# EAGLE design AFM_QFM_input (EAGLE 9.6.2)
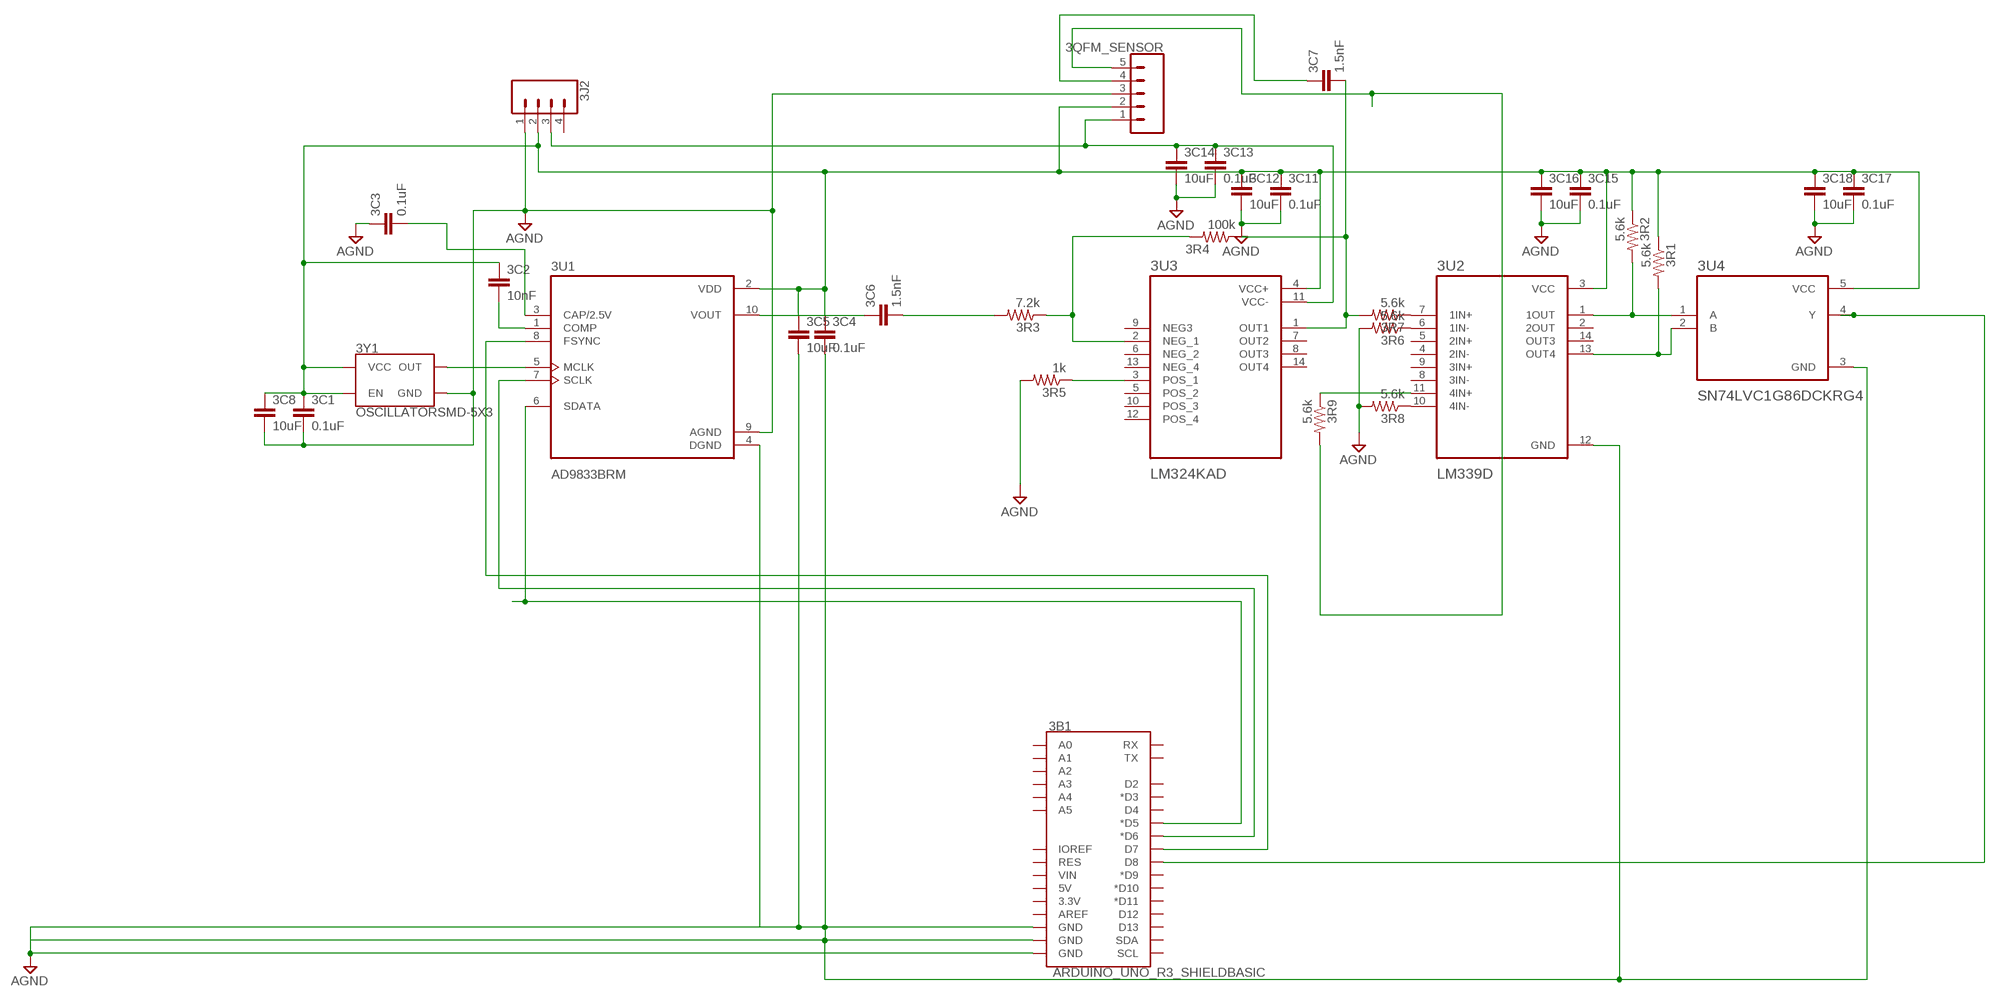
[diagram p0: schematic, sheet 1]

## Parts
3B1  ARDUINO_UNO_R3_SHIELDBASIC  [UNO_R3_SHIELD]
3C1  0.1uF  0.1UF-0603-100V-10%  [0603]
3C2  10nF  10NF-0603-50V-10%  [0603]
3C3  0.1uF  0.1UF-0603-100V-10%  [0603]
3C4  0.1uF  0.1UF-0603-100V-10%  [0603]
3C5  10uF  10UF-0805-10V-10%  [0805]
3C6  1.5nF  C-EUC0603  [C0603]
3C7  1.5nF  C-EUC0603  [C0603]
3C8  10uF  10UF-0805-10V-10%  [0805]
3C11  0.1uF  0.1UF-0603-100V-10%  [0603]
3C12  10uF  10UF-0805-10V-10%  [0805]
3C13  0.1uF  0.1UF-0603-100V-10%  [0603]
3C14  10uF  10UF-0805-10V-10%  [0805]
3C15  0.1uF  0.1UF-0603-100V-10%  [0603]
3C16  10uF  10UF-0805-10V-10%  [0805]
3C17  0.1uF  0.1UF-0603-100V-10%  [0603]
3C18  10uF  10UF-0805-10V-10%  [0805]
3J2  CONN_04LONGPADS  [1X04_LONGPADS]
3QFM_SENSOR  CONN_05PTH_LONGPADS  [1X05_LONGPADS]
3R1  5.6k  R-US_R0603  [R0603]
3R2  5.6k  R-US_R0603  [R0603]
3R3  7.2k  R-US_R0603  [R0603]
3R4  100k  R-US_R0603  [R0603]
3R5  1k  R-US_R0603  [R0603]
3R6  5.6k  R-US_R0603  [R0603]
3R7  5.6k  R-US_R0603  [R0603]
3R8  5.6k  R-US_R0603  [R0603]
3R9  5.6k  R-US_R0603  [R0603]
3U1  AD9833BRM  [SOP50P490X110-10N]
3U2  LM339D  [SOIC127P600X175-14N]
3U3  LM324KAD  [SOIC127P600X175-14N]
3U4  SN74LVC1G86DCKRG4  [SOT65P210X110-5N]
3Y1  OSCILLATORSMD-5X3  [OSCILLATOR-SMD-5X3.2]

## Nets
AGND: 3B1.GND@0(GND) 3B1.GND@1(GND) 3B1.GND@2(GND) 3C1.2 3C3.1 3C4.2 3C5.2 3C8.2 3C11.2 3C12.2 3C13.2 3C14.2 3C15.2 3C16.2 3C17.2 3C18.2 3J2.1 3QFM_SENSOR.3 3R5.2 3R6.2 3R8.2 3U1.4(DGND) 3U1.9(AGND) 3U2.12(GND) 3U4.3(GND) 3Y1.2(GND)
N$1: 3B1.D7 3U1.8(FSYNC)
N$2: 3U1.5(MCLK) 3Y1.3(OUT)
N$3: 3B1.D6(*D6) 3U1.7(SCLK)
N$4: 3B1.D5(*D5) 3U1.6(SDATA)
N$5: 3C2.2 3U1.1(COMP)
N$6: 3C6.1 3U1.10(VOUT)
N$7: 3C3.2 3U1.3(CAP/2.5V)
N$8: 3C6.2 3R3.2
N$10: 3R3.1 3R4.2 3U3.2(NEG_1)
N$11: 3C7.1 3QFM_SENSOR.4
N$12: 3C7.2 3R4.1 3R7.2 3U3.1(OUT1)
N$13: 3R5.1 3U3.3(POS_1)
N$14: 3R6.1 3U2.6(1IN-)
N$15: 3R7.1 3U2.7(1IN+)
N$16: 3R2.2 3U2.1(1OUT) 3U4.1(A)
N$17: 3R8.1 3U2.10(4IN-)
N$18: 3R9.1 3U2.11(4IN+)
N$19: 3QFM_SENSOR.5 3R9.2
N$21: 3R1.2 3U2.13(OUT4) 3U4.2(B)
N$22: 3B1.D8 3U4.4(Y)
VCC: 3C13.1 3C14.1 3J2.3 3QFM_SENSOR.1 3U3.11(VCC-)
VDD3: 3C1.1 3C2.1 3C4.1 3C5.1 3C8.1 3C11.1 3C12.1 3C15.1 3C16.1 3C17.1 3C18.1 3J2.2 3QFM_SENSOR.2 3R1.1 3R2.1 3U1.2(VDD) 3U2.3(VCC) 3U3.4(VCC+) 3U4.5(VCC) 3Y1.1(EN) 3Y1.4(VCC)
Unconnected: 3B1.3.3V 3B1.5V 3B1.A0 3B1.A1 3B1.A2 3B1.A3 3B1.A4 3B1.A5 3B1.AREF 3B1.D2 3B1.D3(*D3) 3B1.D4 3B1.D9(*D9) 3B1.D10(*D10) 3B1.D11(*D11) 3B1.D12 3B1.D13 3B1.IOREF 3B1.RES 3B1.RX 3B1.SCL 3B1.SDA 3B1.TX 3B1.VIN 3J2.4 3U2.2(2OUT) 3U2.4(2IN-) 3U2.5(2IN+) 3U2.8(3IN-) 3U2.9(3IN+) 3U2.14(OUT3) 3U3.5(POS_2) 3U3.6(NEG_2) 3U3.7(OUT2) 3U3.8(OUT3) 3U3.9(NEG3) 3U3.10(POS_3) 3U3.12(POS_4) 3U3.13(NEG_4) 3U3.14(OUT4)

## Library data of the parts
3B1 = SparkFun-Boards:ARDUINO_UNO_R3_SHIELD: Arduino R3 Shield Footprint Shield form compatible with the Arduino Uno R3. SparkFun Products: MG2639 Cellular Shield <https://www.sparkfun.com/products/13120> MIDI Shield <https://www.sparkfun.com/products/12898> R3 Stackable Headers Kit <https://www.sparkfun.com/products/11417>
3C1 3C3 3C4 3C11 3C13 3C15 3C17 = SparkFun-Capacitors:0.1UF: 0.1µF ceramic capacitors A capacitor is a passive two-terminal electrical component used to store electrical energy temporarily in an electric field.; PROD_ID: CAP-08390
3C2 = SparkFun-Capacitors:10NF: 0.01uF/10nF/10,000pF ceramic capacitors A capacitor is a passive two-terminal electrical component used to store electrical energy temporarily in an electric field. CAP-09321; PROD_ID: CAP-00867
3C5 3C8 3C12 3C14 3C16 3C18 = SparkFun-Capacitors:10UF: 10.0µF ceramic capacitors A capacitor is a passive two-terminal electrical component used to store electrical energy temporarily in an electric field.; PROD_ID: CAP-11330
3C6 3C7 = resistor:C-EU: CAPACITOR, European symbol
3J2 = SparkFun-Connectors:CONN_04: Multi connection point. Often used as Generic Header-pin footprint for 0.1 inch spaced/style header connections On any of the 0.1 inch spaced packages, you can populate with these: Break Away Headers - Straight <https://www.sparkfun.com/products/116> (PRT-00116) Break Away Male Headers - Right Angle <https://www.sparkfun.com/products/553> (PRT-00553) Female Headers <https://www.sparkfun.com/products/115> (PRT-00115) Break Away Headers - Machine Pin <https://www.sparkfun.com/products/117> (PRT-00117) Break Away Female Headers - Swiss Machine Pin <https://www.sparkfun.com/products/743> (PRT-00743) For SCREWTERMINALS and SPRING TERMINALS visit here: Screw Terimnals on SparkFun.com <https://www.sparkfun.com/search/results?term=Screw+Terminals> (5mm/3.5mm/2.54mm spacing) This device is also useful as a general connection point to wire up your design to another part of your project. Our various solder wires solder well into these plated through hole pads. Hook-Up Wire - Assortment (Stranded, 22 AWG) <https://www.sparkfun.com/products/11375> (PRT-11375) Hook-Up Wire - Assortment (Solid Core, 22 AWG) <https://www.sparkfun.com/products/11367> (PRT-11367) View the entire wire category on our website here <https://www.sparkfun.com/categories/141> Special notes: Molex polarized connector foot print use with SKU : PRT-08231 with associated crimp pins and housings. 1MM SMD Version SKU: PRT-10208; PROD_ID: CONN-09696
3QFM_SENSOR = SparkFun-Connectors:CONN_05: Multi connection point. Often used as Generic Header-pin footprint for 0.1 inch spaced/style header connections On any of the 0.1 inch spaced packages, you can populate with these: Break Away Headers - Straight <https://www.sparkfun.com/products/116> (PRT-00116) Break Away Male Headers - Right Angle <https://www.sparkfun.com/products/553> (PRT-00553) Female Headers <https://www.sparkfun.com/products/115> (PRT-00115) Break Away Headers - Machine Pin <https://www.sparkfun.com/products/117> (PRT-00117) Break Away Female Headers - Swiss Machine Pin <https://www.sparkfun.com/products/743> (PRT-00743) For SCREWTERMINALS and SPRING TERMINALS visit here: Screw Terimnals on SparkFun.com <https://www.sparkfun.com/search/results?term=Screw+Terminals> (5mm/3.5mm/2.54mm spacing) This device is also useful as a general connection point to wire up your design to another part of your project. Our various solder wires solder well into these plated through hole pads. Hook-Up Wire - Assortment (Stranded, 22 AWG) <https://www.sparkfun.com/products/11375> (PRT-11375) Hook-Up Wire - Assortment (Solid Core, 22 AWG) <https://www.sparkfun.com/products/11367> (PRT-11367) View the entire wire category on our website here <https://www.sparkfun.com/categories/141> Special notes: Molex polarized connector foot print use with SKU : PRT-08231 with associated crimp pins and housings. 1MM SMD Version SKU: PRT-10208
3R1-3R9 = rcl:R-US_: RESISTOR, American symbol; SPICEPREFIX: R
3U1 = AD9833BRM:AD9833BRM: Direct Digital Synthesizer 25MHz 1-DAC 10-Bit Serial 10-Pin MSOP Tube Check availability <https://pricing.snapeda.com/parts/AD9833BRM/Analog%20Devices/view-part?ref=eda>; AVAILABILITY: In Stock; CHECK_PRICES: https://www.snapeda.com/parts/AD9833BRM/Analog+Devices/view-part/?ref=eda; DESCRIPTION: Direct Digital Synthesis IC 10 b 25 MHz 28 b Tuning 10-MSOP; MF: Analog Devices; MP: AD9833BRM; PACKAGE: MSOP-10 Analog Devices; PRICE: None; PURCHASE-URL: https://www.snapeda.com/api/url_track_click_mouser/?unipart_id=107089&manufacturer=Analog Devices&part_name=AD9833BRM&search_term=ad9833; SNAPEDA_LINK: https://www.snapeda.com/parts/AD9833BRM/Analog+Devices/view-part/?ref=snap
3U2 = LM339D:LM339D: Check availability <https://pricing.snapeda.com/parts/LM339D/Texas%20Instruments/view-part?ref=eda>; AVAILABILITY: In Stock; CHECK_PRICES: https://www.snapeda.com/parts/LM339D/Texas+Instruments/view-part/?ref=eda; DESCRIPTION: Quad differential comparator; MF: Texas Instruments; MP: LM339D; PACKAGE: SOIC-14 Texas Instruments; PRICE: None; PURCHASE-URL: https://www.snapeda.com/api/url_track_click_mouser/?unipart_id=4792513&manufacturer=Texas Instruments&part_name=LM339D&search_term=lm339; SNAPEDA_LINK: https://www.snapeda.com/parts/LM339D/Texas+Instruments/view-part/?ref=snap
3U3 = LM324KAD:LM324KAD: Check availability <https://pricing.snapeda.com/parts/LM324KAD/Texas%20Instruments/view-part?ref=eda>; AVAILABILITY: In Stock; CHECK_PRICES: https://www.snapeda.com/parts/LM324KAD/Texas+Instruments/view-part/?ref=eda; DESCRIPTION: Quad, 30-V, 1.2-MHz, 3-mV offset voltage, improved ESD (2kV) operational amplifier; MF: Texas Instruments; MP: LM324KAD; PACKAGE: SOIC-14 Texas Instruments; PRICE: None; PURCHASE-URL: https://www.snapeda.com/api/url_track_click_mouser/?unipart_id=497506&manufacturer=Texas Instruments&part_name=LM324KAD&search_term=lm324; SNAPEDA_LINK: https://www.snapeda.com/parts/LM324KAD/Texas+Instruments/view-part/?ref=snap
3U4 = SN74LVC1G86DCKRG4:SN74LVC1G86DCKRG4: Check availability <https://pricing.snapeda.com/parts/SN74LVC1G86DCKRG4/Texas%20Instruments/view-part?ref=eda>; AVAILABILITY: In Stock; CHECK_PRICES: https://www.snapeda.com/parts/SN74LVC1G86DCKRG4/Texas+Instruments/view-part/?ref=eda; DESCRIPTION: Single 2-input, 1.65-V to 5.5-V XOR (exclusive OR) gate; MF: Texas Instruments; MP: SN74LVC1G86DCKRG4; PACKAGE: SC70-5 Texas Instruments; PRICE: None; SNAPEDA_LINK: https://www.snapeda.com/parts/SN74LVC1G86DCKRG4/Texas+Instruments/view-part/?ref=snap
3Y1 = SparkFun-Clocks:OSCILLATOR: Oscillators (Generic) These are active oscillators, which require a power source to generate their clock output. Most oscillators are configured to generate a set frequency (e.g. 16MHz). They have four pins: power, ground, output, and an enable input.

## Board
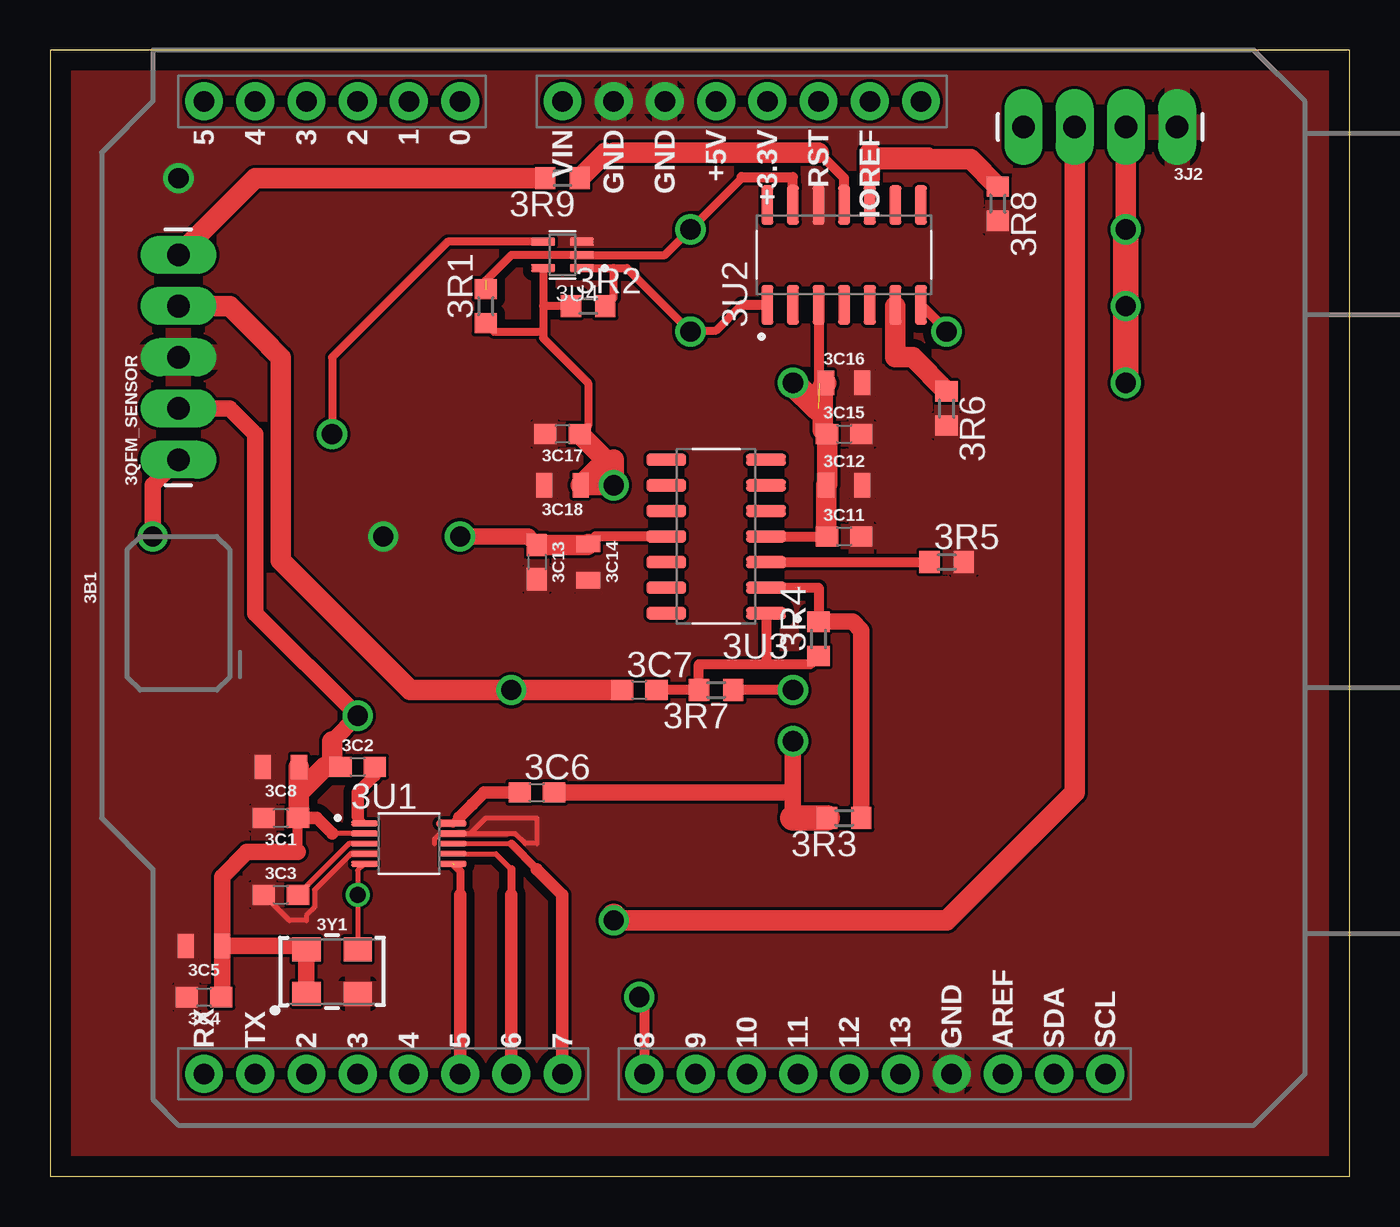
[diagram p1: board, top side]
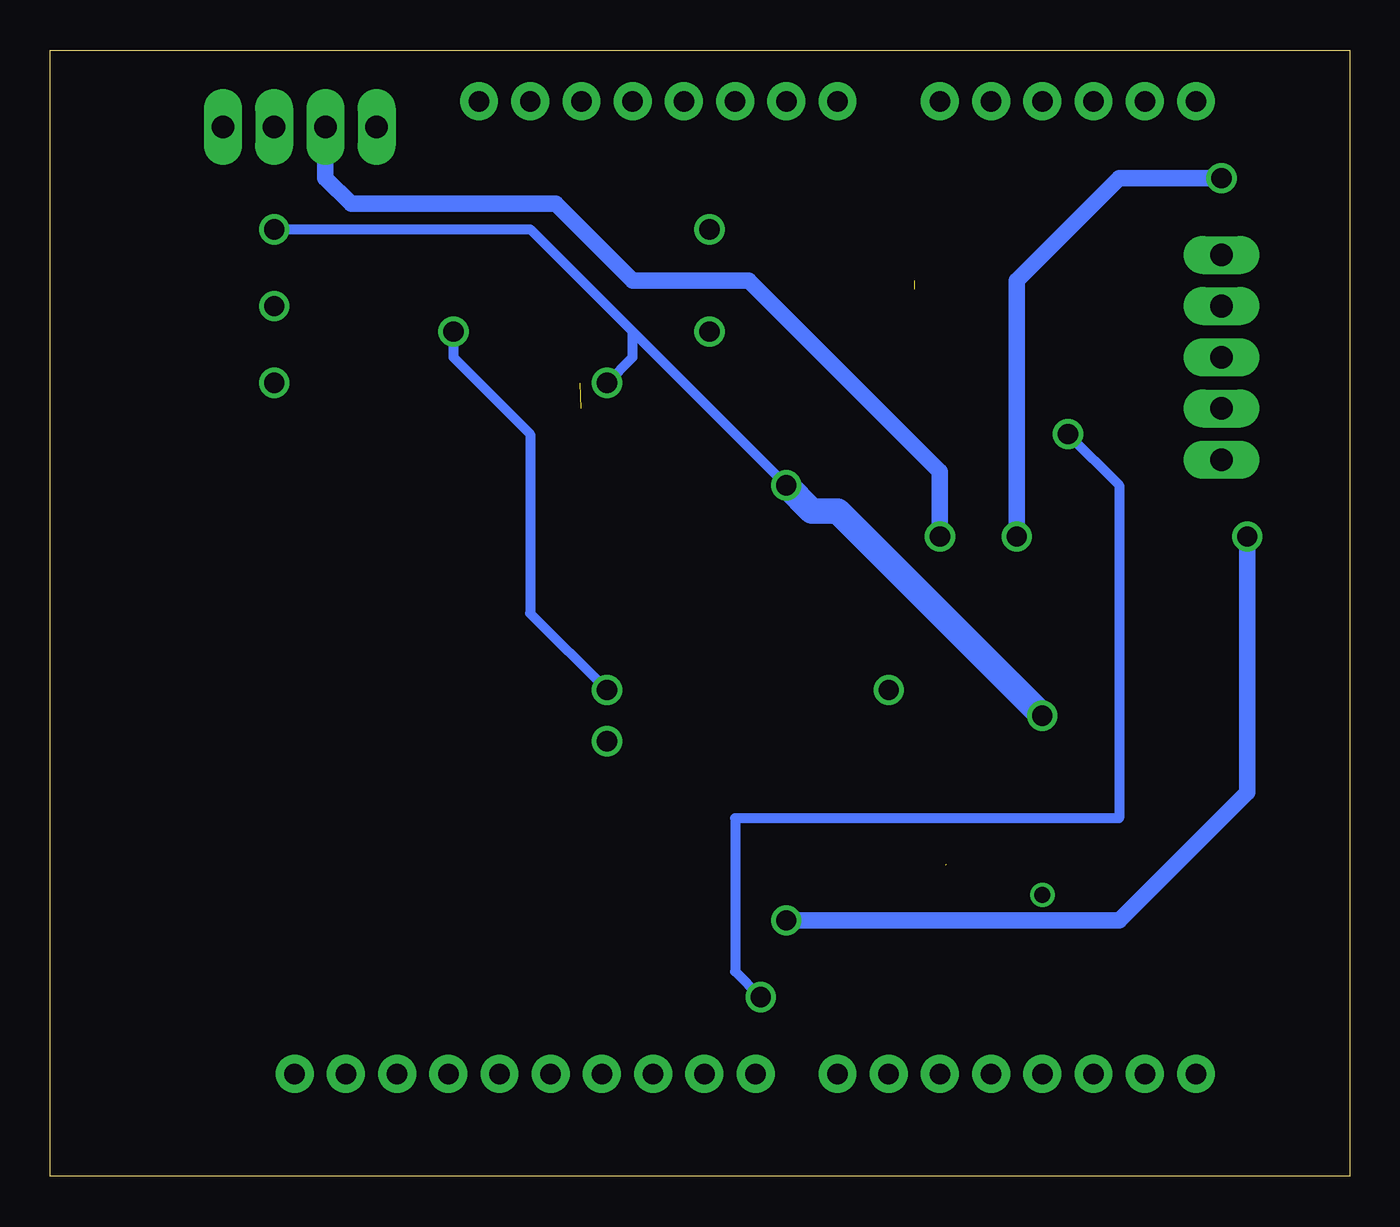
[diagram p2: board, bottom side, seen from below]

Size 64.44 x 55.87 mm. Coordinates in mm from the lower left corner, seen from the top.
Outline: 0,0 64.44,0 64.44,55.87 0,55.87 0,0
Copper layers (1*16): Top 0.035mm / dielectric 1.5mm / Bottom 0.035mm
Design rules "default": minimum track width 6mil, minimum drill 0.35mm, track to track 6mil, track to pad 6mil, pad to pad 6mil, via to via 6mil, smd to smd 6mil, copper to edge 40mil, drill to drill 6mil, minimum pad ring 10mil, minimum via ring 8mil, stop-mask expansion 4mil, vias tented up to drill 0mil, thermal gap 10mil

### Footprints (pad centres in the part's own frame; a part is rotated, then mirrored left to right if it is on the bottom)
UNO_R3_SHIELD = drill 1.016 pad 1.88: 3.3V 24.13,-2.54; 5V 24.13,0; A0 24.13,12.7; A1 24.13,15.24; A2 24.13,17.78; A3 24.13,20.32; A4 24.13,22.86; A5 24.13,25.4; AREF -24.13,-14.224; D2 -24.13,20.32; D3 -24.13,17.78; D4 -24.13,15.24; D5 -24.13,12.7; D6 -24.13,10.16; D7 -24.13,7.62; D8 -24.13,3.556; D9 -24.13,1.016; D10 -24.13,-1.524; D11 -24.13,-4.064; D12 -24.13,-6.604; D13 -24.13,-9.144; GND@0 24.13,2.54; GND@1 24.13,5.08; GND@2 -24.13,-11.684; IOREF 24.13,-7.62; NC 24.13,-10.16; RES 24.13,-5.08; RX -24.13,25.4; SCL -24.13,-19.304; SDA -24.13,-16.764; TX -24.13,22.86; VIN 24.13,7.62
0603 = smd 1.1 x 1: 1 -0.85,0; 2 0.85,0
0805 = smd 0.8 x 1.2: 1 -0.9,0; 2 0.9,0
C0603 = smd 1.1 x 1: 1 -0.85,0; 2 0.85,0
1X04_LONGPADS = drill 1.118 pad 1.88 long: 1 0,0; 2 2.54,0; 3 5.08,0; 4 7.62,0
1X05_LONGPADS = drill 1.118 pad 1.88 long: 1 0,0; 2 2.54,0; 3 5.08,0; 4 7.62,0; 5 10.16,0
R0603 = smd 1 x 1.1: 1 -0.85,0; 2 0.85,0
SOP50P490X110-10N = smd 1.32 x 0.28: 1 -2.2,1; 2 -2.2,0.5; 3 -2.2,0; 4 -2.2,-0.5; 5 -2.2,-1; 6 2.2,-1; 7 2.2,-0.5; 8 2.2,0; 9 2.2,0.5; 10 2.2,1
SOIC127P600X175-14N = smd 1.97 x 0.6: 1 -2.475,3.81; 2 -2.475,2.54; 3 -2.475,1.27; 4 -2.475,0; 5 -2.475,-1.27; 6 -2.475,-2.54; 7 -2.475,-3.81; 8 2.475,-3.81; 9 2.475,-2.54; 10 2.475,-1.27; 11 2.475,0; 12 2.475,1.27; 13 2.475,2.54; 14 2.475,3.81
SOT65P210X110-5N = smd 1.19 x 0.4: 1 -0.96,0.65; 2 -0.96,0; 3 -0.96,-0.65; 4 0.96,-0.65; 5 0.96,0.65
OSCILLATOR-SMD-5X3.2 = smd 1.397 x 1.194: 1 -1.27,-1.1; 2 1.27,-1.1; 3 1.27,1.1; 4 -1.27,1.1

### Placement (x,y rotation side)
3B1  33.02,29.21 90 top
3C1  11.43,17.78 180 top
3C2  15.24,20.32 0 top
3C3  11.43,13.97 0 top
3C4  7.62,8.89 180 top
3C5  7.62,11.43 180 top
3C6  24.13,19.05 0 top
3C7  29.21,24.13 0 top
3C8  11.43,20.32 180 top
3C11  39.37,31.75 0 top
3C12  39.37,34.29 0 top
3C13  24.13,30.48 270 top
3C14  26.67,30.48 270 top
3C15  39.37,36.83 0 top
3C16  39.37,39.37 0 top
3C17  25.4,36.83 180 top
3C18  25.4,34.29 180 top
3J2  55.88,52.07 180 top
3QFM_SENSOR  6.35,35.56 90 top
3R1  21.59,43.18 90 top
3R2  26.67,43.18 0 top
3R3  39.37,17.78 180 top
3R4  38.1,26.67 90 top
3R5  44.45,30.48 0 top
3R6  44.45,38.1 270 top
3R7  33.02,24.13 180 top
3R8  46.99,48.26 270 top
3R9  25.4,49.53 180 top
3U1  17.78,16.51 0 top
3U2  39.37,45.72 90 top
3U3  33.02,31.75 180 top
3U4  25.4,45.72 180 top
3Y1  13.97,10.16 0 top

### Tracks (layer width: path | path; a pad name or v marks a point on that pad's centre or on a via)
AGND  (via drill 1)
  Top 0.254: 3U1.4 14.89,16.01 13.11,14.22 13.11,13.35 12.7,12.95 12.7,12.7 11.85,12.7 3C3.1 | 3U1.9 20.82,17.01 21.59,17.78 24.13,17.78 24.13,16.51 23.54,16.51 23.06,16.99 19.31,16.99 19.04,16.73 19.04,16.51
  Bottom 0.813: v16.51,31.75 16.51,44.45 11.43,49.53 v6.35,49.53
  pour Top (isolate 0.406, rank 6): 0,55.88 64.77,55.88 64.77,0 0,0
  pour Top: 63.5,55.88 63.5,0 -1.27,0 -1.27,55.88
  pour Top: 64.77,55.88 64.77,0 -1.27,0 -1.27,55.88
  pour Top (isolate 0.254): 64.77,55.88 64.77,0 -1.27,0 -1.27,55.88
  pour Top (isolate 0.406): 64.77,55.88 64.77,0 -1.27,0 -1.27,55.88
N$1
  Top 0.254: 3U1.8 22.86,16.51
  Top 0.406: 22.86,16.51 24.13,15.24
  Top 0.61: 3B1.D7 25.4,13.97 24.13,15.24
N$2  (via drill 0.8)
  Top 0.254: 3U1.5 15.24,15.17 v15.24,13.97 15.24,11.43
  Top 0.305: 15.24,11.43 3Y1.3
N$3
  Top 0.254: 3U1.7 22.09,16.01 22.86,15.24
  Top 0.406: 22.86,15.24 22.86,13.97
  Top 0.61: 3B1.D6 22.86,13.97
N$4  (1 unrouted)
  Top 0.305: 20.29,15.21 20.32,15.17
  Top 0.406: 20.04,15.45 20.25,15.24 20.32,15.17 20.32,13.97
  Top 0.61: 3B1.D5 20.32,13.97
N$5
  Top 0.305: 15.24,17.85 3U1.1
  Top 0.61: 3C2.2 16.09,19.9 15.24,19.05 15.24,17.85
N$6
  Top 0.305: 20.29,17.82 3U1.10
  Top 0.406: 19.32,17.51 3U1.10 20.92,18.45
  Top 0.61: 3C6.1 21.52,19.05 20.92,18.45 20.29,17.82
N$7
  Top 0.254: 3U1.3 14.82,16.51 3C3.2
N$8  (via drill 1)
  Top 0.813: v36.83,21.59 36.83,19.05 | 36.83,19.05 36.83,17.78 | 3C6.2 36.83,19.05
  Top 1.27: 36.83,17.78 3R3.2
N$10
  Top 0.508: 3U3.2 38.1,29.21 3R4.2
  Top 0.813: 3R3.1 40.22,27.09 39.79,27.52 3R4.2
N$11  (via drill 1)
  Top 0.508: 11.43,30.55 11.43,40.64 8.89,43.18
  Top 1.016: 3QFM_SENSOR.4 8.89,43.18 10.89,41.18 10.89,41.16 11.43,40.62 11.43,30.55 17.84,24.13 v22.86,24.13 3C7.1
N$12
  Top 0.508: 3U3.1 35.5,25.4 | 3R4.1 37.68,25.4 35.5,25.4 | 35.5,25.4 32.17,25.4 3R7.2 3C7.2
N$13
  Top 0.508: 3U3.3 3R5.1
N$14
  Top 0.508: 41.91,43.18 3U2.6
  Top 1.016: 3R6.1 42.76,40.64 41.91,40.64 41.91,43.18
N$15  (via drill 1)
  Top 0.508: v36.83,24.13 3R7.1 | 3U2.7 44.45,41.98 v44.45,41.91
  Bottom 0.508: v36.83,24.13 40.64,27.94 40.64,36.83 44.45,40.64 v44.45,41.91
N$16  (via drill 1)
  Top 0.406: 3U4.1 27.94,45.07 | 27.94,45.07 28.59,45.07 31.68,41.98 31.75,41.98 | 31.75,41.98 33.02,41.98 34.29,43.24 | v31.75,41.91 31.75,41.98 | 3R2.2 27.94,43.6 27.94,45.07
  Top 0.508: 34.29,43.24 3U2.1
N$17
  Top 0.508: 3U2.10 40.64,49.53 40.64,50.8 43.6,50.8 44.28,50.46
  Top 1.016: 3R8.1 45.64,50.46 44.28,50.46 40.98,50.46 | 40.98,50.46 40.64,50.8 | 40.98,50.46 40.64,50.12 40.64,49.53
N$18
  Top 0.508: 3U2.11 39.37,49.53 38.1,50.8 | 27.52,50.8 27.94,50.8
  Top 1.016: 3R9.1 27.52,50.8 | 27.94,50.8 38.1,50.8
N$19
  Top 0.508: 24.13,49.53 3R9.2
  Top 1.016: 3QFM_SENSOR.5 10.16,49.53 24.13,49.53
N$21  (via drill 1)  (1 unrouted)
  Top 0.406: 34.29,49.59 34.29,49.53 v31.75,46.99 30.48,45.72 3U4.2 22.86,45.72 21.59,44.45
  Top 0.508: 3U2.13 36.83,49.59 34.29,49.59
N$22  (via drill 1)
  Top 0.406: 3U4.4 19.7,46.37 13.97,40.64 v13.97,36.83
  Top 0.508: v29.21,8.89 29.46,8.64 3B1.D8
  Bottom 0.508: v13.97,36.83 11.43,34.29 11.43,17.78 30.48,17.78 30.48,10.16 v29.21,8.89
VCC  (via drill 1)
  Top 0.508: 3U3.11 27.04,31.75 3C14.1
  Top 0.813: 3QFM_SENSOR.1 5.08,34.29 v5.08,31.75 | 3C13.1 23.71,31.75 v20.32,31.75
  Top 1.016: v27.94,12.7 44.45,12.7 50.8,19.05 3J2.3 | 3C14.1 26.62,31.33 3C13.1
  Top 1.27: v27.94,12.7 27.94,12.9
  Bottom 0.813: v27.94,12.7 11.43,12.7 5.08,19.05 v5.08,31.75 | v20.32,31.75 20.32,34.98 29.79,44.45 35.56,44.45 39.37,48.26 49.53,48.26 50.8,49.53 3J2.3
VDD3  (via drill 1)  (1 unrouted)
  Top 0.254: 3U1.2 13.97,17.01
  Top 0.305: 12.33,17.83 3C1.1 | 3C8.1 12.51,20.14 12.51,19.23 | 13.6,20.32 13.97,20.32 3C2.1 | 12.62,11.35 3Y1.4 8.59,11.26 8.47,11.38 | 3C4.1 8.47,11.38 | 8.47,11.38 3C5.1
  Top 0.406: 3U4.5 24.44,43.18 | 24.44,43.18 24.44,41.91 | 24.44,41.91 24.44,41.6 26.67,39.37 26.67,37.25 3C17.1 | 3R1.1 22.01,41.91 24.44,41.91 | 3R2.1 24.44,43.18
  Top 0.508: 12.28,16.09 3C1.1 | 3U3.4 3C11.1 38.47,31.8 | 3C16.1 38.17,39.37 | 3C15.1 38.31,37.04 38.1,37.25 3U2.3
  Top 0.61: 3C1.1 13.2,17.78 13.97,17.01
  Top 0.813: 3C5.1 12.53,11.43 12.62,11.35 | 3Y1.4 3Y1.1 | 3C5.1 8.52,8.94 3C4.1 | 13.97,21.59 v15.24,22.86 10.16,27.94 10.16,36.83 8.89,38.1 3QFM_SENSOR.2 | 3C5.1 8.52,14.87 9.74,16.09 12.28,16.09
  Top 1.016: 13.97,20.32 13.97,21.59 | 13.6,20.32 12.51,19.23 | 3C8.1 12.33,17.83 | 3C17.1 27.54,35.53 3C18.1 v27.94,34.29 27.94,35.56 | 3C15.1 38.52,34.34 3C12.1 38.47,31.8 | 3C16.1 38.31,39.21 38.31,37.04 | v53.34,46.99 3J2.2
  Top 1.27: v36.83,39.37 38.1,38.1 | v53.34,39.37 v53.34,43.18 v53.34,46.99
  Bottom 0.508: v53.34,46.99 40.64,46.99 35.56,41.91 | 35.56,41.91 v27.94,34.29 | v36.83,39.37 35.56,40.64 35.56,41.91
  Bottom 1.27: v27.94,34.29 26.67,33.02 25.4,33.02 v15.24,22.86